# Altium schematic sheet Power_Distribution.SchDoc
size A3; SheetNumber: 2; SheetTotal: 12
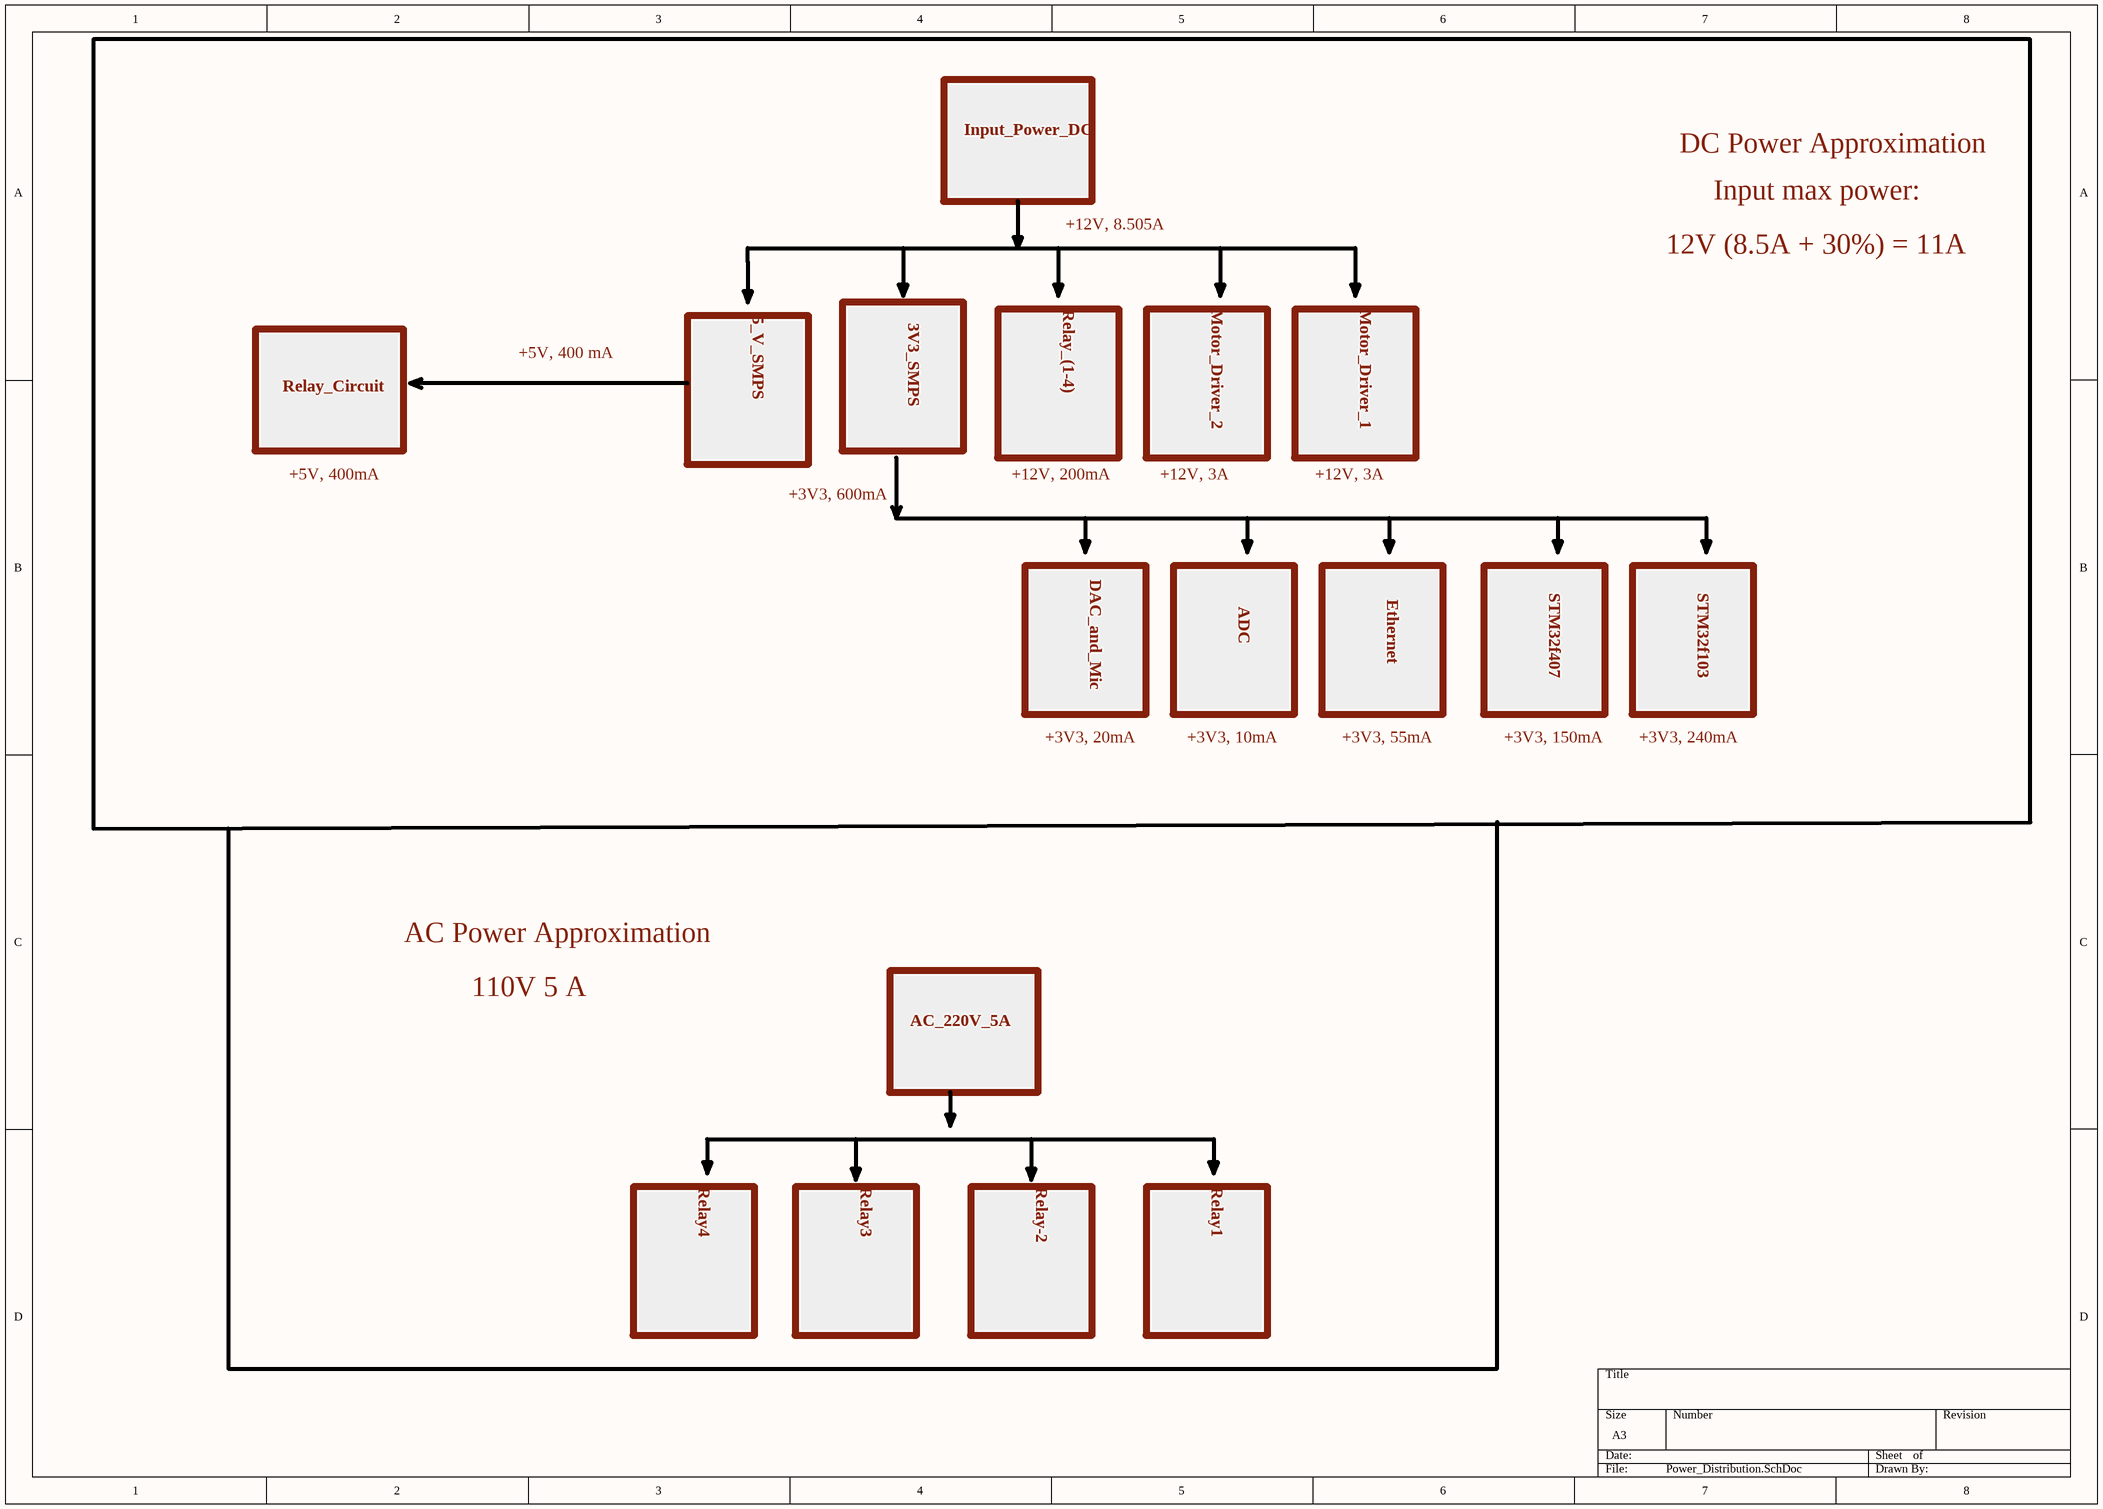
[diagram p0: Power_Distribution.SchDoc]

## Notes on the sheet
- Input_Power_DC
- DC Power Approximation
- +12V, 8.505A
- Input max power:
- 5_V_SMPS
- 3V3_SMPS
- Relay_(1-4)
- Motor_Driver_2
- Motor_Driver_1
- 12V (8.5A + 30%) = 11A
- +5V, 400 mA
- Relay_Circuit
- +5V, 400mA
- +3V3, 600mA
- +12V, 200mA
- +12V, 3A
- DAC_and_Mic
- STM32f407
- STM32f103
- ADC
- Ethernet
- +3V3, 20mA
- +3V3, 10mA
- +3V3, 55mA
- +3V3, 150mA
- +3V3, 240mA
- AC Power Approximation
- 110V 5 A
- AC_220V_5A
- Relay4
- Relay3
- Relay-2
- Relay1